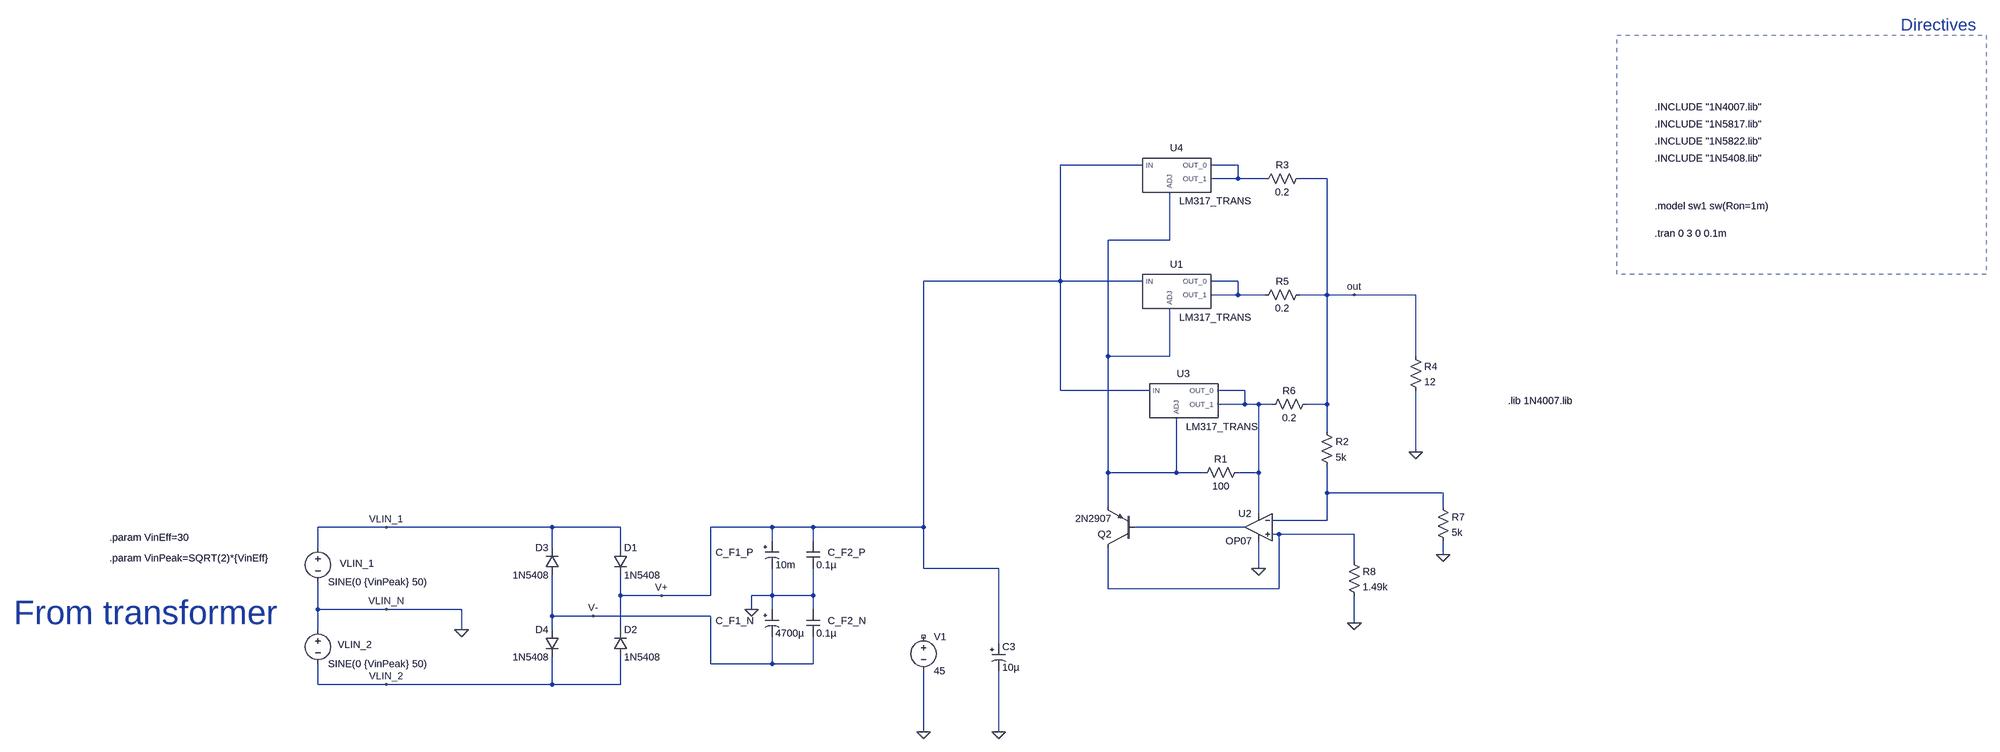
[diagram p0: schematic power_supply_C_V_0.1.asc]
power_supply_C_V_0.1.asc, the LTspice schematic file:
Version 4
SHEET 1 4716 680
WIRE 2448 -1392 2256 -1392
WIRE 2672 -1392 2608 -1392
WIRE 2672 -1360 2672 -1392
WIRE 2672 -1360 2608 -1360
WIRE 2736 -1360 2672 -1360
WIRE 2880 -1360 2816 -1360
WIRE 2512 -1216 2512 -1328
WIRE 2512 -1216 2368 -1216
WIRE 2256 -1120 2256 -1392
WIRE 2256 -1120 1936 -1120
WIRE 2448 -1120 2256 -1120
WIRE 2672 -1120 2608 -1120
WIRE 2672 -1088 2672 -1120
WIRE 2672 -1088 2608 -1088
WIRE 2736 -1088 2672 -1088
WIRE 2880 -1088 2880 -1360
WIRE 2880 -1088 2816 -1088
WIRE 2944 -1088 2880 -1088
WIRE 3088 -1088 2944 -1088
WIRE 2368 -944 2368 -1216
WIRE 2512 -944 2512 -1056
WIRE 2512 -944 2368 -944
WIRE 3088 -944 3088 -1088
WIRE 2256 -864 2256 -1120
WIRE 2464 -864 2256 -864
WIRE 2688 -864 2624 -864
WIRE 2688 -832 2688 -864
WIRE 2688 -832 2624 -832
WIRE 2720 -832 2688 -832
WIRE 2752 -832 2720 -832
WIRE 2880 -832 2880 -1088
WIRE 2880 -832 2832 -832
WIRE 2880 -768 2880 -832
WIRE 3088 -720 3088 -864
WIRE 2368 -672 2368 -944
WIRE 2528 -672 2528 -800
WIRE 2528 -672 2368 -672
WIRE 2592 -672 2528 -672
WIRE 2720 -672 2720 -832
WIRE 2720 -672 2672 -672
WIRE 2880 -624 2880 -688
WIRE 3152 -624 2880 -624
WIRE 2368 -592 2368 -672
WIRE 3152 -592 3152 -624
WIRE 2720 -576 2720 -672
WIRE 2880 -560 2880 -624
WIRE 2880 -560 2752 -560
WIRE -96 -544 -256 -544
WIRE 752 -544 -96 -544
WIRE 912 -544 752 -544
WIRE 1280 -544 1136 -544
WIRE 1376 -544 1280 -544
WIRE 1936 -544 1936 -1120
WIRE 1936 -544 1376 -544
WIRE 2688 -544 2432 -544
WIRE 2768 -528 2752 -528
WIRE 2944 -528 2768 -528
WIRE 1280 -512 1280 -544
WIRE 1376 -512 1376 -544
WIRE -256 -496 -256 -544
WIRE 752 -496 752 -544
WIRE 912 -496 912 -544
WIRE 3152 -480 3152 -512
WIRE 2944 -464 2944 -528
WIRE 1936 -448 1936 -544
WIRE 2112 -448 1936 -448
WIRE 2720 -448 2720 -512
WIRE 2368 -400 2368 -496
WIRE 2768 -400 2768 -528
WIRE 2768 -400 2368 -400
WIRE 912 -384 912 -432
WIRE 1008 -384 912 -384
WIRE 1136 -384 1136 -544
WIRE 1136 -384 1008 -384
WIRE 1280 -384 1280 -448
WIRE 1280 -384 1232 -384
WIRE 1376 -384 1376 -448
WIRE 1376 -384 1280 -384
WIRE -256 -352 -256 -416
WIRE -96 -352 -256 -352
WIRE 80 -352 -96 -352
WIRE 1232 -352 1232 -384
WIRE 1280 -352 1280 -384
WIRE 1376 -352 1376 -384
WIRE 752 -336 752 -432
WIRE 848 -336 752 -336
WIRE 1136 -336 848 -336
WIRE 2944 -320 2944 -384
WIRE -256 -304 -256 -352
WIRE 80 -304 80 -352
WIRE 752 -304 752 -336
WIRE 912 -304 912 -384
WIRE 2112 -272 2112 -448
WIRE 1136 -224 1136 -336
WIRE 1280 -224 1280 -288
WIRE 1280 -224 1136 -224
WIRE 1376 -224 1376 -288
WIRE 1376 -224 1280 -224
WIRE -256 -176 -256 -224
WIRE -96 -176 -256 -176
WIRE 752 -176 752 -240
WIRE 752 -176 -96 -176
WIRE 912 -176 912 -240
WIRE 912 -176 752 -176
WIRE 1936 -32 1936 -208
WIRE 2112 -32 2112 -208
FLAG -96 -544 VLIN_1
FLAG -96 -176 VLIN_2
FLAG -96 -352 VLIN_N
FLAG 80 -304 0
FLAG 848 -336 V-
FLAG 1008 -384 V+
FLAG 1232 -352 0
FLAG 1936 -32 0
FLAG 3088 -720 0
FLAG 2112 -32 0
FLAG 2944 -1088 out
FLAG 2720 -448 0
FLAG 3152 -480 0
FLAG 2944 -320 0
SYMBOL voltage -256 -512 R0
WINDOW 123 0 0 Left 2
WINDOW 39 0 0 Left 2
WINDOW 0 51 53 Left 2
SYMATTR InstName VLIN_1
SYMATTR Value SINE(0 {VinPeak} 50)
SYMBOL diode 896 -496 R0
SYMATTR InstName D1
SYMATTR Value 1N5408
SYMBOL diode 896 -240 M180
WINDOW 0 24 64 Left 2
WINDOW 3 24 0 Left 2
SYMATTR InstName D2
SYMATTR Value 1N5408
SYMBOL polcap 1264 -512 R0
WINDOW 0 -116 27 Left 2
WINDOW 3 24 56 Left 2
SYMATTR InstName C_F1_P
SYMATTR Value 10m
SYMATTR Description Capacitor
SYMATTR Type cap
SYMATTR SpiceLine V=35 Irms=1.45 Rser=0.044 Lser=0 mfg="Nichicon" pn="UPR1V222MRH" type="Al electrolytic"
SYMBOL cap 1360 -512 R0
WINDOW 0 50 27 Left 2
SYMATTR InstName C_F2_P
SYMATTR Value 0.1µ
SYMATTR SpiceLine V=4 Irms=1.62 Rser=0.0464862 Lser=0 mfg="KEMET" pn="C0402C104K7PAC" type="X5R"
SYMBOL diode 768 -432 R180
WINDOW 0 24 64 Left 2
WINDOW 3 24 0 Left 2
SYMATTR InstName D3
SYMATTR Value 1N5408
SYMBOL diode 768 -304 M0
SYMATTR InstName D4
SYMATTR Value 1N5408
SYMBOL voltage -256 -320 R0
WINDOW 123 0 0 Left 2
WINDOW 39 0 0 Left 2
WINDOW 0 46 51 Left 2
SYMATTR InstName VLIN_2
SYMATTR Value SINE(0 {VinPeak} 50)
SYMBOL polcap 1264 -352 R0
WINDOW 0 -116 27 Left 2
WINDOW 3 24 56 Left 2
SYMATTR InstName C_F1_N
SYMATTR Value 4700µ
SYMATTR Description Capacitor
SYMATTR Type cap
SYMATTR SpiceLine V=35 Irms=1.45 Rser=0.044 Lser=0 mfg="Nichicon" pn="UPR1V222MRH" type="Al electrolytic"
SYMBOL cap 1360 -352 R0
WINDOW 0 50 27 Left 2
SYMATTR InstName C_F2_N
SYMATTR Value 0.1µ
SYMATTR SpiceLine V=4 Irms=1.62 Rser=0.0464862 Lser=0 mfg="KEMET" pn="C0402C104K7PAC" type="X5R"
SYMBOL LM317_TRANS 2528 -1104 R0
WINDOW 3 91 53 Top 2
SYMATTR InstName U1
SYMBOL res 2688 -688 R90
WINDOW 0 0 56 VBottom 2
WINDOW 3 32 56 VTop 2
SYMATTR InstName R1
SYMATTR Value 100
SYMBOL voltage 1936 -304 R0
SYMATTR InstName V1
SYMATTR Value 45
SYMBOL res 3072 -960 R0
SYMATTR InstName R4
SYMATTR Value 12
SYMBOL pnp 2432 -496 R180
SYMATTR InstName Q2
SYMATTR Value 2N2907
SYMBOL polcap 2096 -272 R0
SYMATTR InstName C3
SYMATTR Value 10µ
SYMBOL Opamps\\OP07 2720 -608 M0
SYMATTR InstName U2
SYMBOL LM317_TRANS 2544 -848 R0
WINDOW 3 91 53 Top 2
SYMATTR InstName U3
SYMBOL LM317_TRANS 2528 -1376 R0
WINDOW 3 91 53 Top 2
SYMATTR InstName U4
SYMBOL res 2832 -1376 R90
WINDOW 0 0 56 VBottom 2
WINDOW 3 32 56 VTop 2
SYMATTR InstName R3
SYMATTR Value 0.2
SYMBOL res 2832 -1104 R90
WINDOW 0 0 56 VBottom 2
WINDOW 3 32 56 VTop 2
SYMATTR InstName R5
SYMATTR Value 0.2
SYMBOL res 2848 -848 R90
WINDOW 0 0 56 VBottom 2
WINDOW 3 32 56 VTop 2
SYMATTR InstName R6
SYMATTR Value 0.2
SYMBOL res 2864 -784 R0
SYMATTR InstName R2
SYMATTR Value 5k
SYMBOL res 3136 -608 R0
SYMATTR InstName R7
SYMATTR Value 5k
SYMBOL res 2928 -480 R0
SYMATTR InstName R8
SYMATTR Value 1.49k
TEXT -968 -344 Left 6 ;From transformer
TEXT 3912 -1232 Left 2 !.tran 0 3 0 0.1m
TEXT 3912 -1528 Left 2 !.INCLUDE "1N4007.lib"
TEXT 3912 -1488 Left 2 !.INCLUDE "1N5817.lib"
TEXT 3912 -1448 Left 2 !.INCLUDE "1N5822.lib"
TEXT 3912 -1296 Left 2 !.model sw1 sw(Ron=1m)
TEXT 4488 -1720 Left 4 ;Directives
TEXT 3912 -1408 Left 2 !.INCLUDE "1N5408.lib"
TEXT -744 -520 Left 2 !.param VinEff=30
TEXT -744 -472 Left 2 !.param VinPeak=SQRT(2)*{VinEff}
TEXT 3512 -840 Left 2 !.lib 1N4007.lib
RECTANGLE Normal 4688 -1136 3824 -1696 3

The netlist it stands for:
* power_supply_C_V_0.1.asc
VLIN_1 VLIN_1 0 SINE(0 {VinPeak} 50)
D1 VLIN_1 V+ 1N5408
D2 VLIN_2 V+ 1N5408
C_F1_P V+ 0 10m V=35 Irms=1.45 Rser=0.044 Lser=0 mfg="Nichicon" pn="UPR1V222MRH" type="Al electrolytic"
C_F2_P V+ 0 0.1µ V=4 Irms=1.62 Rser=0.0464862 Lser=0 mfg="KEMET" pn="C0402C104K7PAC" type="X5R"
D3 V- VLIN_1 1N5408
D4 V- VLIN_2 1N5408
VLIN_2 0 VLIN_2 SINE(0 {VinPeak} 50)
C_F1_N 0 V- 4700µ V=35 Irms=1.45 Rser=0.044 Lser=0 mfg="Nichicon" pn="UPR1V222MRH" type="Al electrolytic"
C_F2_N 0 V- 0.1µ V=4 Irms=1.62 Rser=0.0464862 Lser=0 mfg="KEMET" pn="C0402C104K7PAC" type="X5R"
XU1 V+ N002 N003 N003 LM317_TRANS  ; pins IN ADJ OUT_0 OUT_1
R1 N004 N002 100
V1 NC_01 0 45
R4 out 0 12
Q2 N007 N006 N002 0 2N2907
C3 V+ 0 10µ
XU2 N007 N005 N004 0 N006 LT1001  ; OP07, pins In+ In- V+ V- OUT
XU3 V+ N002 N004 N004 LM317_TRANS  ; pins IN ADJ OUT_0 OUT_1
XU4 V+ N002 N001 N001 LM317_TRANS  ; pins IN ADJ OUT_0 OUT_1
R3 out N001 0.2
R5 out N003 0.2
R6 out N004 0.2
R2 out N005 5k
R7 N005 0 5k
R8 N007 0 1.49k
.model D D
.lib standard.dio
.model NPN NPN
.model PNP PNP
.lib standard.bjt
* From transformer
.tran 0 3 0 0.1m
.INCLUDE "1N4007.lib"
.INCLUDE "1N5817.lib"
.INCLUDE "1N5822.lib"
.model sw1 sw(Ron=1m)
* Directives
.INCLUDE "1N5408.lib"
.param VinEff=30
.param VinPeak=SQRT(2)*{VinEff}
.lib 1N4007.lib
.lib LM317_TRANS.LIB
.lib LTC.lib
.backanno
.end